# EAGLE design LPFlasher-v2.0 (EAGLE 7.6.0)
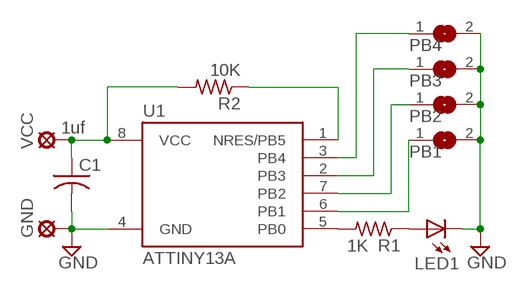
[diagram p0: schematic, sheet 1]

## Parts
C1  1uf  C-US025-024X044  [C025-024X044]
GND  LSP13  [LSP13]
LED1  LED5MM  [LED5MM]
PB1  JUMPER  [SJW]
PB2  JUMPER  [SJW]
PB3  JUMPER  [SJW]
PB4  JUMPER  [SJW]
R1  1K  R-US_0204/2V  [0204V]
R2  10K  R-US_0204/2V  [0204V]
U1  ATTINY13A  ATTINY25-P  [PDIP08_300MIL]
VCC  LSP13  [LSP13]

## Nets
GND: C1.2 GND.MP LED1.K(C) PB1.2 PB2.2 PB3.2 PB4.2 U1.4(GND)
N$1: R1.2 U1.5(PB0)
N$2: LED1.A R1.1
N$3: R2.1 U1.1(NRES/PB5)
N$4: PB4.1 U1.3(PB4)
N$5: PB3.1 U1.2(PB3)
N$6: PB2.1 U1.7(PB2)
N$7: PB1.1 U1.6(PB1)
VCC: C1.1 R2.2 U1.8(VCC) VCC.MP

## Library data of the parts
C1 = adafruit:C-US: CAPACITOR, American symbol
GND VCC = solpad:LSP13: SOLDER PAD drill 1.3 mm, distributor Buerklin, 12H562
LED1 = led:LED: LED OSRAM: - CHIPLED LG R971, LG N971, LY N971, LG Q971, LY Q971, LO R971, LY R971 LH N974, LH R974 LS Q976, LO Q976, LY Q976 LO Q996 - Hyper CHIPLED LW Q18S LB Q993, LB Q99A, LB R99A - SideLED LS A670, LO A670, LY A670, LG A670, LP A670 LB A673, LV A673, LT A673, LW A673 LH A674 LY A675 LS A676, LA A676, LO A676, LY A676, LW A676 LS A679, LY A679, LG A679 - Hyper Micro SIDELED® LS Y876, LA Y876, LO Y876, LY Y876 LT Y87S - SmartLED LW L88C, LW L88S LB L89C, LB L89S, LG L890 LS L89K, LO L89K, LY L89K LS L896, LA L896, LO L896, LY L896 - TOPLED LS T670, LO T670, LY T670, LG T670, LP T670 LSG T670, LSP T670, LSY T670, LOP T670, LYG T670 LG T671, LOG T671, LSG T671 LB T673, LV T673, LT T673, LW T673 LH T674 LS T676, LA T676, LO T676, LY T676, LB T676, LH T676, LSB T676, LW T676 LB T67C, LV T67C, LT T67C, LS T67K, LO T67K, LY T67K, LW E67C LS E67B, LA E67B, LO E67B, LY E67B, LB E67C, LV E67C, LT E67C LW T67C LS T679, LY T679, LG T679 LS T770, LO T770, LY T770, LG T770, LP T770 LB T773, LV T773, LT T773, LW T773 LH T774 LS E675, LA E675, LY E675, LS T675 LS T776, LA T776, LO T776, LY T776, LB T776 LHGB T686 LT T68C, LB T68C - Hyper Mini TOPLED® LB M676 - Mini TOPLED Santana® LG M470 LS M47K, LO M47K, LY M47K Source: http://www.osram.convergy.de LUXEON: - LUMILED® LXK2-PW12-R00, LXK2-PW12-S00, LXK2-PW14-U00, LXK2-PW14-V00 LXK2-PM12-R00, LXK2-PM12-S00, LXK2-PM14-U00 LXK2-PE12-Q00, LXK2-PE12-R00, LXK2-PE12-S00, LXK2-PE14-T00, LXK2-PE14-U00 LXK2-PB12-K00, LXK2-PB12-L00, LXK2-PB12-M00, LXK2-PB14-N00, LXK2-PB14-P00, LXK2-PB14-Q00 LXK2-PR12-L00, LXK2-PR12-M00, LXK2-PR14-Q00, LXK2-PR14-R00 LXK2-PD12-Q00, LXK2-PD12-R00, LXK2-PD12-S00 LXK2-PH12-R00, LXK2-PH12-S00 LXK2-PL12-P00, LXK2-PL12-Q00, LXK2-PL12-R00 Source: www.luxeon.com KINGBRIGHT: KA-3528ASYC Source: www.kingbright.com
PB1-PB4 = BaseApp:JUMPER
R1 R2 = resistor:R-US_: RESISTOR, American symbol
U1 = _hhn_attiny25_45_85:ATTINY25*: ATMEL ATtiny 25 Packages: P = PDIP 08 30mil S = SOIC 08 EIAJ 208mil SS = SOIC 08 JEDEC 150mil Technologies Note: for complete ordering code (temp. range, finish, tape&reel etc.) see www.atmel.com • Supply Voltage: V = (1.8…5.5)V | [blank] = (2.7…5.5)V • Speed: 10 = 10 MHz | 20 = 20 MHz Author: Dipl.-Ing. FH Rainer Bayer HHN Hochschule Heilbronn (Heilbronn University), rainer.bayer@hs-heilbronn.de Ingenieurbüro ing-rb, mail@ing-rb.de

## Board
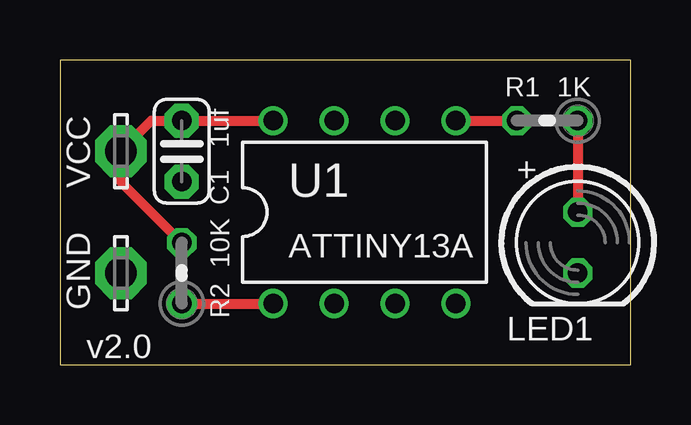
[diagram p1: board, top side]
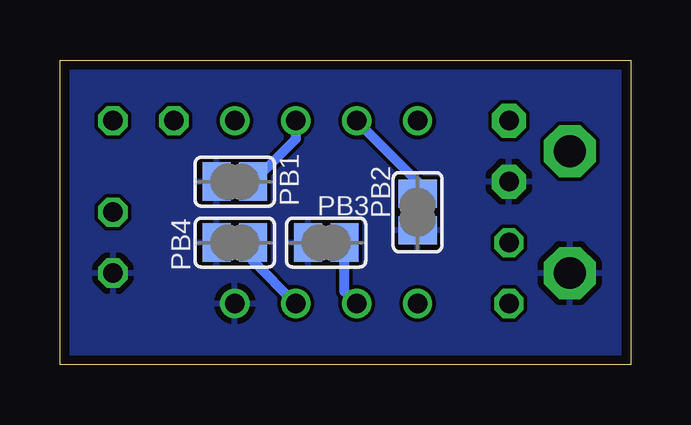
[diagram p2: board, bottom side, seen from below]

Size 23.8 x 12.69 mm. Coordinates in mm from the lower left corner, seen from the top.
Outline: 0,0 23.8,0 23.8,12.69 0,12.69 0,0
Copper layers (1*16): Top 0.0356mm / dielectric 1.5011mm / Bottom 0.0356mm
Design rules "OSHPark": minimum track width 6mil, minimum drill 13mil, track to track 6mil, track to pad 6mil, pad to pad 6mil, via to via 6mil, smd to smd 6mil, copper to edge 15mil, drill to drill 6mil, minimum pad ring 7mil, minimum via ring 7mil, stop-mask expansion 4mil, vias tented up to drill 0mil, thermal gap 10mil

### Footprints (pad centres in the part's own frame; a part is rotated, then mirrored left to right if it is on the bottom)
C025-024X044 = drill 0.813 pad 1.422 octagon: 1 -1.27,0; 2 1.27,0
LSP13 = drill 1.321 pad 2.159 octagon: MP 0,0
LED5MM = drill 0.813 octagon: A -1.27,0; K 1.27,0
SJW = smd 1.168 x 1.6: 1 -0.762,0; 2 0.762,0
0204V = drill 0.813 octagon: 1 -1.27,0; 2 1.27,0
PDIP08_300MIL = drill 0.813: 1 -3.81,-3.81; 2 -1.27,-3.81; 3 1.27,-3.81; 4 3.81,-3.81; 5 3.81,3.81; 6 1.27,3.81; 7 -1.27,3.81; 8 -3.81,3.81

### Placement (x,y rotation side)
C1  5.08,8.89 270 top
GND  2.54,3.81 90 top
LED1  21.59,5.08 270 top
PB1  16.51,7.62 180 bottom
PB2  8.89,6.35 270 bottom
PB3  12.7,5.08 180 bottom
PB4  16.51,5.08 180 bottom
R1  20.32,10.16 180 top
R2  5.08,3.81 90 top
U1  12.7,6.35 0 top
VCC  2.54,8.89 90 top

### Tracks (layer width: path | path; a pad name or v marks a point on that pad's centre or on a via)
GND
  pour Bottom: 0,0 24.13,0 24.13,12.7 0,12.7
N$1
  Top 0.406: U1.5 R1.2
N$2
  Top 0.406: R1.1 LED1.A
N$3
  Top 0.406: R2.1 U1.1
N$4
  Bottom 0.406: U1.3 15.75,4.32 PB4.1
N$5
  Bottom 0.406: U1.2 11.94,3.05 PB3.1
N$6
  Bottom 0.406: U1.7 8.89,7.62 PB2.1
N$7
  Bottom 0.406: U1.6 13.97,9.4 PB1.1
VCC
  Top 0.406: U1.8 C1.1 3.81,10.16 VCC.MP 2.54,7.62 R2.2

### Text on the board
tPlace: +
tNames: v2.0